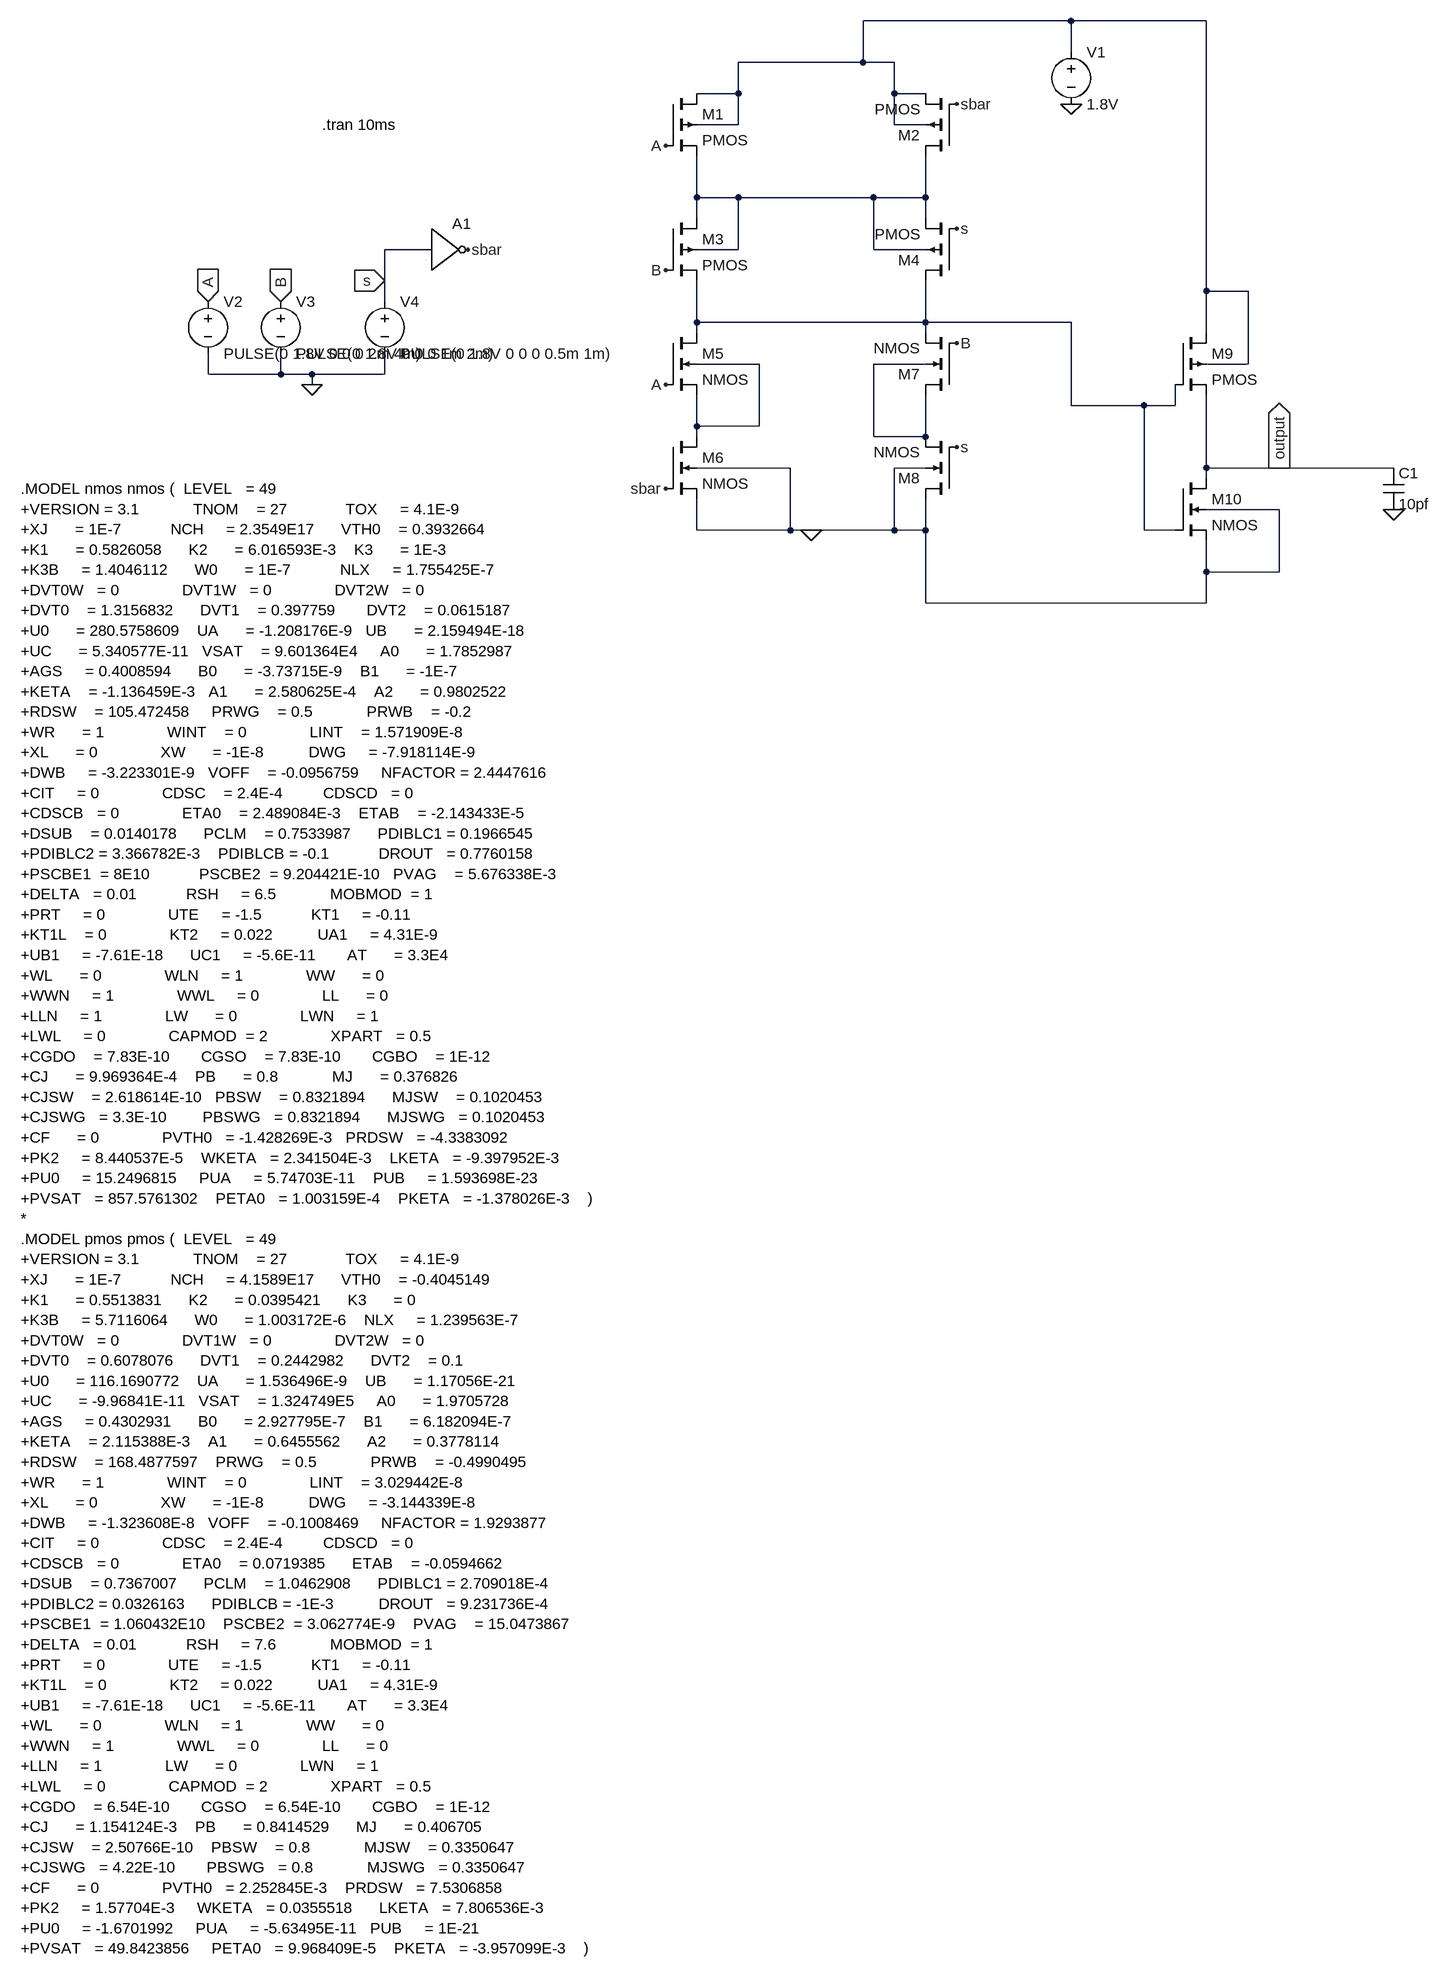
[diagram p0: schematic mux2x1.asc]
mux2x1.asc, the LTspice schematic file:
Version 4
SHEET 1 1280 2704
WIRE 720 -48 400 -48
WIRE 928 -48 720 -48
WIRE 720 0 720 -48
WIRE 400 16 400 -48
WIRE 400 16 208 16
WIRE 448 16 400 16
WIRE 208 64 208 16
WIRE 208 64 144 64
WIRE 448 64 448 16
WIRE 496 64 448 64
WIRE 208 112 208 64
WIRE 208 112 144 112
WIRE 448 112 448 64
WIRE 496 112 448 112
WIRE 144 224 144 160
WIRE 208 224 144 224
WIRE 416 224 208 224
WIRE 496 224 496 160
WIRE 496 224 416 224
WIRE 144 256 144 224
WIRE 496 256 496 224
WIRE -272 304 -336 304
WIRE 208 304 208 224
WIRE 208 304 144 304
WIRE 416 304 416 224
WIRE 496 304 416 304
WIRE -336 352 -336 304
WIRE 928 368 928 -48
WIRE 992 368 928 368
WIRE -336 384 -336 352
WIRE 144 416 144 352
WIRE 496 416 496 352
WIRE 496 416 144 416
WIRE 720 416 496 416
WIRE 144 432 144 416
WIRE 496 432 496 416
WIRE 928 432 928 368
WIRE 240 480 144 480
WIRE 496 480 416 480
WIRE 992 480 992 368
WIRE 992 480 928 480
WIRE -608 496 -608 464
WIRE -496 496 -496 464
WIRE -496 496 -608 496
WIRE -448 496 -496 496
WIRE -336 496 -336 464
WIRE -336 496 -448 496
WIRE -448 512 -448 496
WIRE 720 544 720 416
WIRE 832 544 720 544
WIRE 880 544 880 512
WIRE 880 544 832 544
WIRE 144 576 144 528
WIRE 240 576 240 480
WIRE 240 576 144 576
WIRE 144 592 144 576
WIRE 416 592 416 480
WIRE 496 592 496 528
WIRE 496 592 416 592
WIRE 288 640 144 640
WIRE 496 640 448 640
WIRE 928 640 928 528
WIRE 1040 640 928 640
WIRE 1216 640 1040 640
WIRE 928 656 928 640
WIRE 1040 704 928 704
WIRE 144 736 144 688
WIRE 288 736 288 640
WIRE 288 736 144 736
WIRE 320 736 288 736
WIRE 448 736 448 640
WIRE 448 736 320 736
WIRE 496 736 496 688
WIRE 496 736 448 736
WIRE 832 736 832 544
WIRE 880 736 832 736
WIRE 928 800 928 752
WIRE 1040 800 1040 704
WIRE 1040 800 928 800
WIRE 496 848 496 736
WIRE 928 848 928 800
WIRE 928 848 496 848
FLAG 320 736 0
FLAG 720 80 0
FLAG 1216 704 0
FLAG -448 512 0
FLAG -608 384 A
IOPIN -608 384 In
FLAG -496 384 B
IOPIN -496 384 In
FLAG -208 304 sbar
FLAG -336 352 s
IOPIN -336 352 In
FLAG 96 144 A
FLAG 96 512 A
FLAG 96 336 B
FLAG 544 448 B
FLAG 544 80 sbar
FLAG 96 672 sbar
FLAG 544 272 s
FLAG 544 608 s
FLAG 1040 640 output
IOPIN 1040 640 Out
SYMBOL pmos4 96 64 R0
SYMATTR InstName M1
SYMATTR Value2 l=180nm w=360nm
SYMBOL pmos4 96 256 R0
SYMATTR InstName M3
SYMATTR Value2 l=180nm w=360nm
SYMBOL pmos4 544 160 R180
SYMATTR InstName M2
SYMATTR Value2 l=180nm w=360nm
SYMBOL pmos4 544 352 R180
SYMATTR InstName M4
SYMATTR Value2 l=180nm w=360nm
SYMBOL nmos4 96 432 R0
SYMATTR InstName M5
SYMATTR Value2 l=180nm w=360nm
SYMBOL nmos4 96 592 R0
SYMATTR InstName M6
SYMATTR Value2 l=180nm w=360nm
SYMBOL nmos4 544 528 R180
SYMATTR InstName M7
SYMATTR Value2 l=180nm w=360nm
SYMBOL nmos4 544 688 R180
SYMATTR InstName M8
SYMATTR Value2 l=180nm w=360nm
SYMBOL pmos4 880 432 R0
SYMATTR InstName M9
SYMATTR Value2 l=180nm w=360nm
SYMBOL nmos4 880 656 R0
SYMATTR InstName M10
SYMATTR Value2 l=180nm w=360nm
SYMBOL voltage 720 -16 R0
SYMATTR InstName V1
SYMATTR Value 1.8V
SYMBOL cap 1200 640 R0
SYMATTR InstName C1
SYMATTR Value 10pf
SYMBOL voltage -608 368 R0
WINDOW 123 0 0 Left 0
WINDOW 39 0 0 Left 0
SYMATTR InstName V2
SYMATTR Value PULSE(0 1.8V 0 0 0 2m 4m)
SYMBOL voltage -496 368 R0
WINDOW 123 0 0 Left 0
WINDOW 39 0 0 Left 0
SYMATTR InstName V3
SYMATTR Value PULSE(0 1.8V 0 0 0 1m 2m)
SYMBOL voltage -336 368 R0
WINDOW 123 0 0 Left 0
WINDOW 39 0 0 Left 0
SYMATTR InstName V4
SYMATTR Value PULSE(0 1.8V 0 0 0 0.5m 1m)
SYMBOL Digital\\inv -272 240 R0
SYMATTR InstName A1
TEXT -896 672 Left 2 !.MODEL nmos nmos (  LEVEL   = 49\n+VERSION = 3.1            TNOM    = 27             TOX     = 4.1E-9\n+XJ      = 1E-7           NCH     = 2.3549E17      VTH0    = 0.3932664\n+K1      = 0.5826058      K2      = 6.016593E-3    K3      = 1E-3\n+K3B     = 1.4046112      W0      = 1E-7           NLX     = 1.755425E-7\n+DVT0W   = 0              DVT1W   = 0              DVT2W   = 0\n+DVT0    = 1.3156832      DVT1    = 0.397759       DVT2    = 0.0615187\n+U0      = 280.5758609    UA      = -1.208176E-9   UB      = 2.159494E-18\n+UC      = 5.340577E-11   VSAT    = 9.601364E4     A0      = 1.7852987\n+AGS     = 0.4008594      B0      = -3.73715E-9    B1      = -1E-7\n+KETA    = -1.136459E-3   A1      = 2.580625E-4    A2      = 0.9802522\n+RDSW    = 105.472458     PRWG    = 0.5            PRWB    = -0.2\n+WR      = 1              WINT    = 0              LINT    = 1.571909E-8\n+XL      = 0              XW      = -1E-8          DWG     = -7.918114E-9\n+DWB     = -3.223301E-9   VOFF    = -0.0956759     NFACTOR = 2.4447616\n+CIT     = 0              CDSC    = 2.4E-4         CDSCD   = 0\n+CDSCB   = 0              ETA0    = 2.489084E-3    ETAB    = -2.143433E-5\n+DSUB    = 0.0140178      PCLM    = 0.7533987      PDIBLC1 = 0.1966545\n+PDIBLC2 = 3.366782E-3    PDIBLCB = -0.1           DROUT   = 0.7760158\n+PSCBE1  = 8E10           PSCBE2  = 9.204421E-10   PVAG    = 5.676338E-3\n+DELTA   = 0.01           RSH     = 6.5            MOBMOD  = 1\n+PRT     = 0              UTE     = -1.5           KT1     = -0.11\n+KT1L    = 0              KT2     = 0.022          UA1     = 4.31E-9\n+UB1     = -7.61E-18      UC1     = -5.6E-11       AT      = 3.3E4\n+WL      = 0              WLN     = 1              WW      = 0\n+WWN     = 1              WWL     = 0              LL      = 0\n+LLN     = 1              LW      = 0              LWN     = 1\n+LWL     = 0              CAPMOD  = 2              XPART   = 0.5\n+CGDO    = 7.83E-10       CGSO    = 7.83E-10       CGBO    = 1E-12\n+CJ      = 9.969364E-4    PB      = 0.8            MJ      = 0.376826\n+CJSW    = 2.618614E-10   PBSW    = 0.8321894      MJSW    = 0.1020453\n+CJSWG   = 3.3E-10        PBSWG   = 0.8321894      MJSWG   = 0.1020453\n+CF      = 0              PVTH0   = -1.428269E-3   PRDSW   = -4.3383092\n+PK2     = 8.440537E-5    WKETA   = 2.341504E-3    LKETA   = -9.397952E-3\n+PU0     = 15.2496815     PUA     = 5.74703E-11    PUB     = 1.593698E-23\n+PVSAT   = 857.5761302    PETA0   = 1.003159E-4    PKETA   = -1.378026E-3    )\n*\n.MODEL pmos pmos (  LEVEL   = 49\n+VERSION = 3.1            TNOM    = 27             TOX     = 4.1E-9\n+XJ      = 1E-7           NCH     = 4.1589E17      VTH0    = -0.4045149\n+K1      = 0.5513831      K2      = 0.0395421      K3      = 0\n+K3B     = 5.7116064      W0      = 1.003172E-6    NLX     = 1.239563E-7\n+DVT0W   = 0              DVT1W   = 0              DVT2W   = 0\n+DVT0    = 0.6078076      DVT1    = 0.2442982      DVT2    = 0.1\n+U0      = 116.1690772    UA      = 1.536496E-9    UB      = 1.17056E-21\n+UC      = -9.96841E-11   VSAT    = 1.324749E5     A0      = 1.9705728\n+AGS     = 0.4302931      B0      = 2.927795E-7    B1      = 6.182094E-7\n+KETA    = 2.115388E-3    A1      = 0.6455562      A2      = 0.3778114\n+RDSW    = 168.4877597    PRWG    = 0.5            PRWB    = -0.4990495\n+WR      = 1              WINT    = 0              LINT    = 3.029442E-8\n+XL      = 0              XW      = -1E-8          DWG     = -3.144339E-8\n+DWB     = -1.323608E-8   VOFF    = -0.1008469     NFACTOR = 1.9293877\n+CIT     = 0              CDSC    = 2.4E-4         CDSCD   = 0\n+CDSCB   = 0              ETA0    = 0.0719385      ETAB    = -0.0594662\n+DSUB    = 0.7367007      PCLM    = 1.0462908      PDIBLC1 = 2.709018E-4\n+PDIBLC2 = 0.0326163      PDIBLCB = -1E-3          DROUT   = 9.231736E-4\n+PSCBE1  = 1.060432E10    PSCBE2  = 3.062774E-9    PVAG    = 15.0473867\n+DELTA   = 0.01           RSH     = 7.6            MOBMOD  = 1\n+PRT     = 0              UTE     = -1.5           KT1     = -0.11\n+KT1L    = 0              KT2     = 0.022          UA1     = 4.31E-9\n+UB1     = -7.61E-18      UC1     = -5.6E-11       AT      = 3.3E4\n+WL      = 0              WLN     = 1              WW      = 0\n+WWN     = 1              WWL     = 0              LL      = 0\n+LLN     = 1              LW      = 0              LWN     = 1\n+LWL     = 0              CAPMOD  = 2              XPART   = 0.5\n+CGDO    = 6.54E-10       CGSO    = 6.54E-10       CGBO    = 1E-12\n+CJ      = 1.154124E-3    PB      = 0.8414529      MJ      = 0.406705\n+CJSW    = 2.50766E-10    PBSW    = 0.8            MJSW    = 0.3350647\n+CJSWG   = 4.22E-10       PBSWG   = 0.8            MJSWG   = 0.3350647\n+CF      = 0              PVTH0   = 2.252845E-3    PRDSW   = 7.5306858\n+PK2     = 1.57704E-3     WKETA   = 0.0355518      LKETA   = 7.806536E-3\n+PU0     = -1.6701992     PUA     = -5.63495E-11   PUB     = 1E-21\n+PVSAT   = 49.8423856     PETA0   = 9.968409E-5    PKETA   = -3.957099E-3    )
TEXT -432 112 Left 2 !.tran 10ms

The netlist it stands for:
* mux2x1.asc
M1 N001 A N002 N001 PMOS l=180nm w=360nm
M3 N002 B N003 N002 PMOS l=180nm w=360nm
M2 N002 sbar N001 N001 PMOS l=180nm w=360nm
M4 N003 s N002 N002 PMOS l=180nm w=360nm
M5 N003 A N004 N004 NMOS l=180nm w=360nm
M6 N004 sbar 0 0 NMOS l=180nm w=360nm
M7 N005 B N003 N005 NMOS l=180nm w=360nm
M8 0 s N005 0 NMOS l=180nm w=360nm
M9 N001 N003 output N001 PMOS l=180nm w=360nm
M10 output N003 0 0 NMOS l=180nm w=360nm
V1 N001 0 1.8V
C1 output 0 10pf
V2 A 0 PULSE(0 1.8V 0 0 0 2m 4m)
V3 B 0 PULSE(0 1.8V 0 0 0 1m 2m)
V4 s 0 PULSE(0 1.8V 0 0 0 0.5m 1m)
A1 s 0 0 0 0 sbar 0 0 BUF
.model NMOS NMOS
.model PMOS PMOS
.lib standard.mos
.MODEL nmos nmos (  LEVEL   = 49
+VERSION = 3.1            TNOM    = 27             TOX     = 4.1E-9
+XJ      = 1E-7           NCH     = 2.3549E17      VTH0    = 0.3932664
+K1      = 0.5826058      K2      = 6.016593E-3    K3      = 1E-3
+K3B     = 1.4046112      W0      = 1E-7           NLX     = 1.755425E-7
+DVT0W   = 0              DVT1W   = 0              DVT2W   = 0
+DVT0    = 1.3156832      DVT1    = 0.397759       DVT2    = 0.0615187
+U0      = 280.5758609    UA      = -1.208176E-9   UB      = 2.159494E-18
+UC      = 5.340577E-11   VSAT    = 9.601364E4     A0      = 1.7852987
+AGS     = 0.4008594      B0      = -3.73715E-9    B1      = -1E-7
+KETA    = -1.136459E-3   A1      = 2.580625E-4    A2      = 0.9802522
+RDSW    = 105.472458     PRWG    = 0.5            PRWB    = -0.2
+WR      = 1              WINT    = 0              LINT    = 1.571909E-8
+XL      = 0              XW      = -1E-8          DWG     = -7.918114E-9
+DWB     = -3.223301E-9   VOFF    = -0.0956759     NFACTOR = 2.4447616
+CIT     = 0              CDSC    = 2.4E-4         CDSCD   = 0
+CDSCB   = 0              ETA0    = 2.489084E-3    ETAB    = -2.143433E-5
+DSUB    = 0.0140178      PCLM    = 0.7533987      PDIBLC1 = 0.1966545
+PDIBLC2 = 3.366782E-3    PDIBLCB = -0.1           DROUT   = 0.7760158
+PSCBE1  = 8E10           PSCBE2  = 9.204421E-10   PVAG    = 5.676338E-3
+DELTA   = 0.01           RSH     = 6.5            MOBMOD  = 1
+PRT     = 0              UTE     = -1.5           KT1     = -0.11
+KT1L    = 0              KT2     = 0.022          UA1     = 4.31E-9
+UB1     = -7.61E-18      UC1     = -5.6E-11       AT      = 3.3E4
+WL      = 0              WLN     = 1              WW      = 0
+WWN     = 1              WWL     = 0              LL      = 0
+LLN     = 1              LW      = 0              LWN     = 1
+LWL     = 0              CAPMOD  = 2              XPART   = 0.5
+CGDO    = 7.83E-10       CGSO    = 7.83E-10       CGBO    = 1E-12
+CJ      = 9.969364E-4    PB      = 0.8            MJ      = 0.376826
+CJSW    = 2.618614E-10   PBSW    = 0.8321894      MJSW    = 0.1020453
+CJSWG   = 3.3E-10        PBSWG   = 0.8321894      MJSWG   = 0.1020453
+CF      = 0              PVTH0   = -1.428269E-3   PRDSW   = -4.3383092
+PK2     = 8.440537E-5    WKETA   = 2.341504E-3    LKETA   = -9.397952E-3
+PU0     = 15.2496815     PUA     = 5.74703E-11    PUB     = 1.593698E-23
+PVSAT   = 857.5761302    PETA0   = 1.003159E-4    PKETA   = -1.378026E-3    )
*
.MODEL pmos pmos (  LEVEL   = 49
+VERSION = 3.1            TNOM    = 27             TOX     = 4.1E-9
+XJ      = 1E-7           NCH     = 4.1589E17      VTH0    = -0.4045149
+K1      = 0.5513831      K2      = 0.0395421      K3      = 0
+K3B     = 5.7116064      W0      = 1.003172E-6    NLX     = 1.239563E-7
+DVT0W   = 0              DVT1W   = 0              DVT2W   = 0
+DVT0    = 0.6078076      DVT1    = 0.2442982      DVT2    = 0.1
+U0      = 116.1690772    UA      = 1.536496E-9    UB      = 1.17056E-21
+UC      = -9.96841E-11   VSAT    = 1.324749E5     A0      = 1.9705728
+AGS     = 0.4302931      B0      = 2.927795E-7    B1      = 6.182094E-7
+KETA    = 2.115388E-3    A1      = 0.6455562      A2      = 0.3778114
+RDSW    = 168.4877597    PRWG    = 0.5            PRWB    = -0.4990495
+WR      = 1              WINT    = 0              LINT    = 3.029442E-8
+XL      = 0              XW      = -1E-8          DWG     = -3.144339E-8
+DWB     = -1.323608E-8   VOFF    = -0.1008469     NFACTOR = 1.9293877
+CIT     = 0              CDSC    = 2.4E-4         CDSCD   = 0
+CDSCB   = 0              ETA0    = 0.0719385      ETAB    = -0.0594662
+DSUB    = 0.7367007      PCLM    = 1.0462908      PDIBLC1 = 2.709018E-4
+PDIBLC2 = 0.0326163      PDIBLCB = -1E-3          DROUT   = 9.231736E-4
+PSCBE1  = 1.060432E10    PSCBE2  = 3.062774E-9    PVAG    = 15.0473867
+DELTA   = 0.01           RSH     = 7.6            MOBMOD  = 1
+PRT     = 0              UTE     = -1.5           KT1     = -0.11
+KT1L    = 0              KT2     = 0.022          UA1     = 4.31E-9
+UB1     = -7.61E-18      UC1     = -5.6E-11       AT      = 3.3E4
+WL      = 0              WLN     = 1              WW      = 0
+WWN     = 1              WWL     = 0              LL      = 0
+LLN     = 1              LW      = 0              LWN     = 1
+LWL     = 0              CAPMOD  = 2              XPART   = 0.5
+CGDO    = 6.54E-10       CGSO    = 6.54E-10       CGBO    = 1E-12
+CJ      = 1.154124E-3    PB      = 0.8414529      MJ      = 0.406705
+CJSW    = 2.50766E-10    PBSW    = 0.8            MJSW    = 0.3350647
+CJSWG   = 4.22E-10       PBSWG   = 0.8            MJSWG   = 0.3350647
+CF      = 0              PVTH0   = 2.252845E-3    PRDSW   = 7.5306858
+PK2     = 1.57704E-3     WKETA   = 0.0355518      LKETA   = 7.806536E-3
+PU0     = -1.6701992     PUA     = -5.63495E-11   PUB     = 1E-21
+PVSAT   = 49.8423856     PETA0   = 9.968409E-5    PKETA   = -3.957099E-3    )
.tran 10ms
.backanno
.end